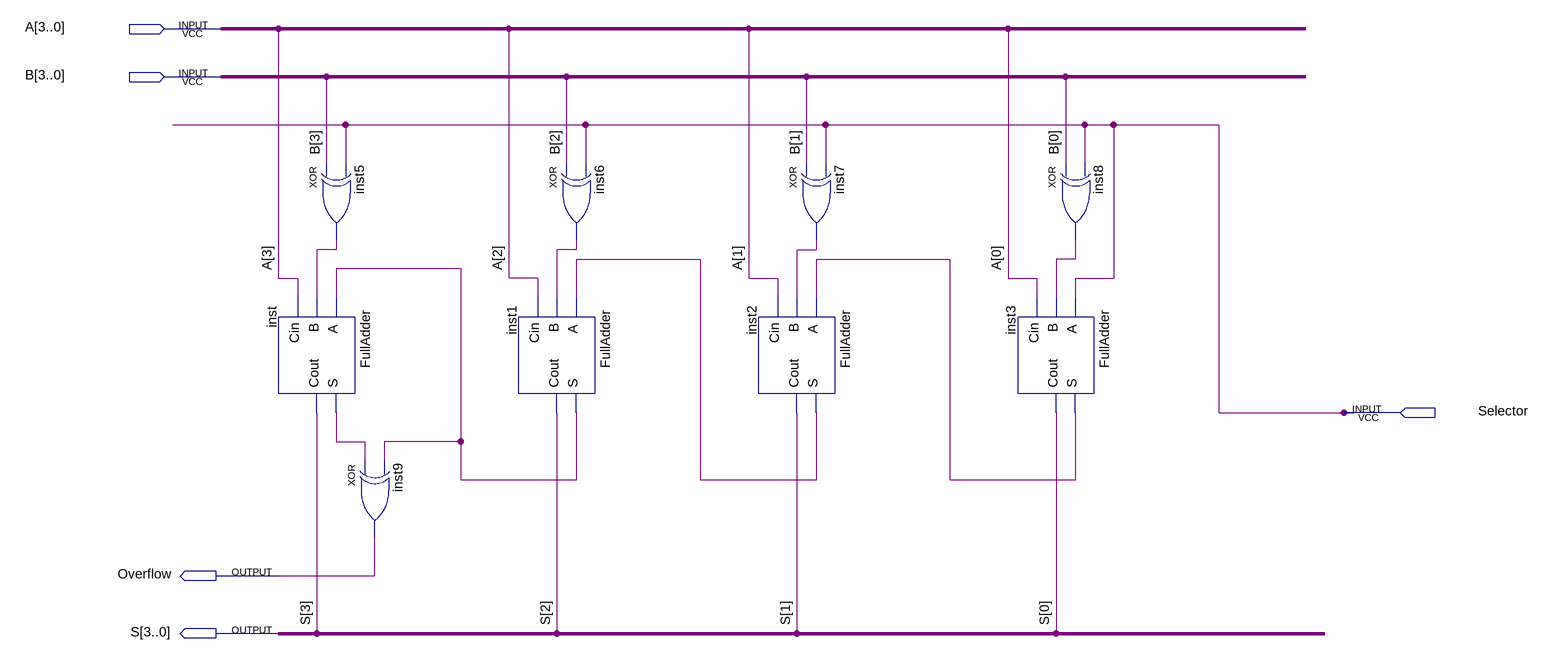
[diagram p0: schematic sheet]
// Quartus schematic AdderSubtracter.bdf as structural Verilog: 9 symbols, 5 pins
module AdderSubtracter (
  input  [3:0] A,
  input  [3:0] B,
  input  Selector,
  output Overflow,
  output [3:0] S
);

  wire inst1_s, inst2_s, inst3_s, inst5_out, inst6_out, inst7_out, inst8_out, inst_s;

  FullAdder inst (.A(inst1_s), .B(inst5_out), .Cin(A[3]), .S(inst_s), .Cout(S[3]));
  xor inst5 (inst5_out, B[3], Selector);
  xor inst9 (Overflow, inst_s, inst1_s);
  FullAdder inst1 (.A(inst2_s), .B(inst6_out), .Cin(A[2]), .S(inst1_s), .Cout(S[2]));
  xor inst6 (inst6_out, B[2], Selector);
  FullAdder inst2 (.A(inst3_s), .B(inst7_out), .Cin(A[1]), .S(inst2_s), .Cout(S[1]));
  xor inst7 (inst7_out, B[1], Selector);
  xor inst8 (inst8_out, B[0], Selector);
  FullAdder inst3 (.A(Selector), .B(inst8_out), .Cin(A[0]), .S(inst3_s), .Cout(S[0]));
endmodule
